# EAGLE schematic SIM800L (EAGLE 7.5.0)
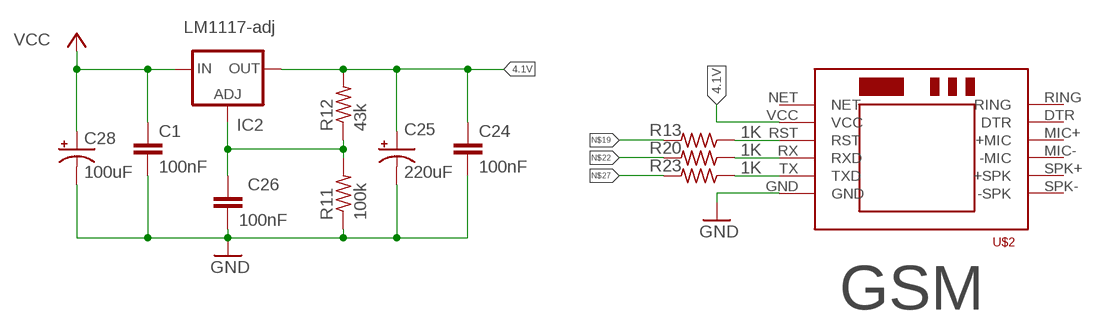
[diagram p0: schematic, sheet 1]

## Parts
C1  100nF  C-EU050-024X044  [C050-024X044]
C24  100nF  C-EU050-024X044  [C050-024X044]
C25  220uF  CPOL-USE2.5-6  [E2,5-6]
C26  100nF  C-EU050-024X044  [C050-024X044]
C28  100uF  CPOL-USE2.5-6  [E2,5-6]
IC2  LM1117-adj  LD117AS25TR  [SOT223]
R11  100k  R-US_0204/7  [0204/7]
R12  43k  R-US_0204/7  [0204/7]
R13  1K  R-US_0204/7  [0204/7]
R20  1K  R-US_0204/7  [0204/7]
R23  1K  R-US_0204/7  [0204/7]
U$2  SIM800LMODULE  [SIM800LMODULE]

## Nets
4.1V: C24.1 C25.+ IC2.4(OUT) R12.2 U$2.VCC
GND: C1.2 C24.2 C25.- C26.2 C28.- R11.1 U$2.GND
N$5: C26.1 IC2.1(ADJ) R11.2 R12.1
N$14: R13.1 U$2.RST
N$17: R20.1 U$2.RX(RXD)
N$18: R23.1 U$2.TX(TXD)
N$19: R13.2
N$22: R20.2
N$27: R23.2
VCC: C1.1 C28.+ IC2.3(IN)
Unconnected: U$2.DTR U$2.MIC+(+MIC) U$2.MIC-(-MIC) U$2.NET U$2.RING U$2.SPK+(+SPK) U$2.SPK-(-SPK)

## Notes on the sheet
- GSM

## Library data of the parts
C1 C24 C26 = rcl:C-EU: CAPACITOR, European symbol
C25 C28 = rcl:CPOL-US: POLARIZED CAPACITOR, American symbol
IC2 = v-reg:LD117A?*: Low drop fixed and adjustable positive voltage regulators 1 A Source: http://www.st.com/stonline/products/literature/ds/7194/ld1117axx.pdf
R11-R13 R20 R23 = resistor:R-US_: RESISTOR, American symbol
U$2 = SIM800LMODULE:SIM800LMODULE: SIM800L Module

## Net classes
1 vcc: width 0.254 mm